# EasyEDA schematic test 2.json
TITLE: 30V AC to 24V DC converter; REV: 1.0; Date: 2021-05-12; Sheet: 1/1; Drawn By: Mohd Aman Ansari; Company: embed.io
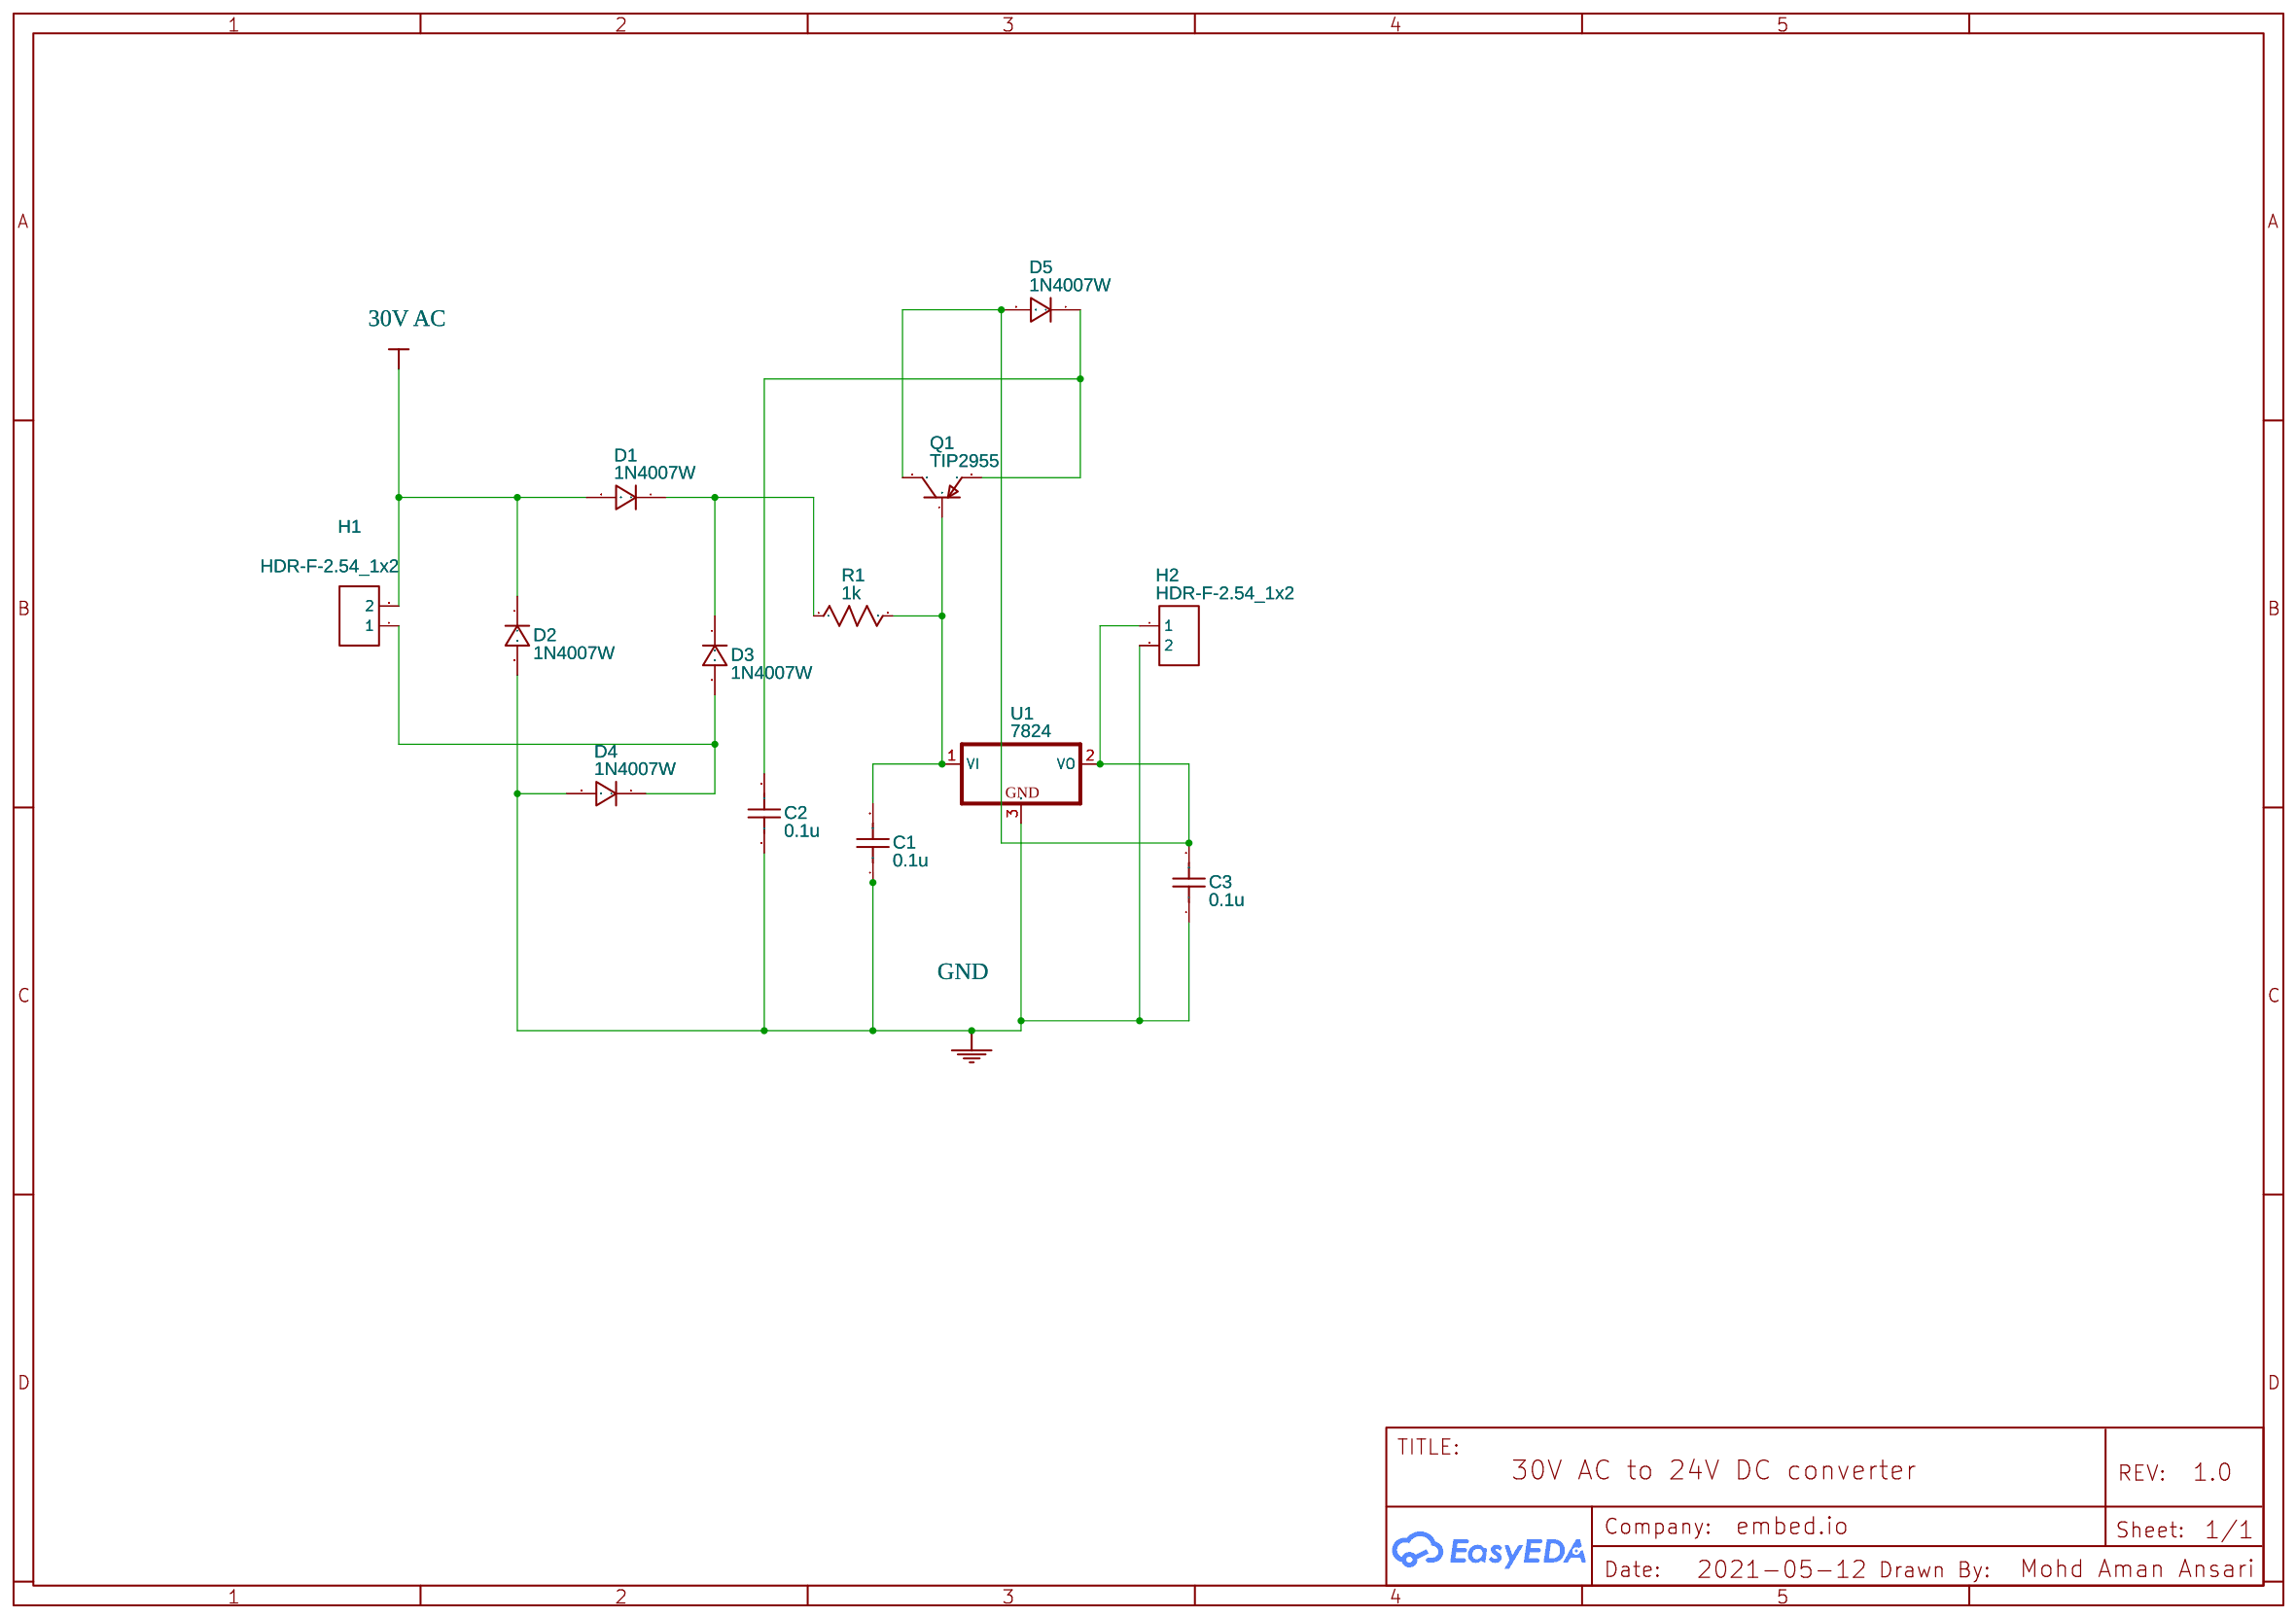
[diagram p0: schematic sheet]

## Parts
C1  0.1u  [C0603]
C2  0.1u  [C0603]
C3  0.1u  [C0603]
D1  1N4007W  [SOD-123_L2.8-W1.8-LS3.7-RD]
D2  1N4007W  [SOD-123_L2.8-W1.8-LS3.7-RD]
D3  1N4007W  [SOD-123_L2.8-W1.8-LS3.7-RD]
D4  1N4007W  [SOD-123_L2.8-W1.8-LS3.7-RD]
D5  1N4007W  [SOD-123_L2.8-W1.8-LS3.7-RD]
H1  HDR-F-2.54_1x2  [HDR-F-2.54_1X2]
H2  HDR-F-2.54_1x2  [HDR-F-2.54_1X2]
Q1  TIP2955  [TO-247AC-3_L15.8-W5.0-P5.46-L]
R1  1k  [R0603]
U1  7824  [TO252]

## Library data of the parts
C1-C3 = C_0603_US: Contributor: LCEDA_Lib
D1-D5 = 1N4007W: Supplier: LCSC; Supplier Part: C328592; Manufacturer: BLUE ROCKET; Contributor: LCEDA_Lib
H1 H2 = HDR-F-2.54_1x2: Supplier Part: C49661; Supplier: LCSC; Contributor: LCEDA_Lib
Q1 = TIP2955: Supplier: LCSC; Supplier Part: C262991; Manufacturer: STMicroelectronics; Contributor: LCSC; JLCPCB Part Class: Extended Part
R1 = R_0603_US: Contributor: LCEDA_Lib
U1 = 7824: Contributor: Adafruit

## Nets
30V AC: D1.2 D2.1 H1.2
GND: C1.1 C2.1 C3.1 D2.2 D4.2 H2.2 U1.3(GND)
Net-(C1-2): C1.2 Q1.1(B) R1.2 U1.1(VI)
Net-(C2-2): C2.2 D5.1 Q1.3(E)
Net-(C3-2): C3.2 D5.2 H2.1 Q1.2(C) U1.2(VO)
Net-(D1-1): D1.1 D3.1 R1.1
Net-(D3-2): D3.2 D4.1 H1.1
